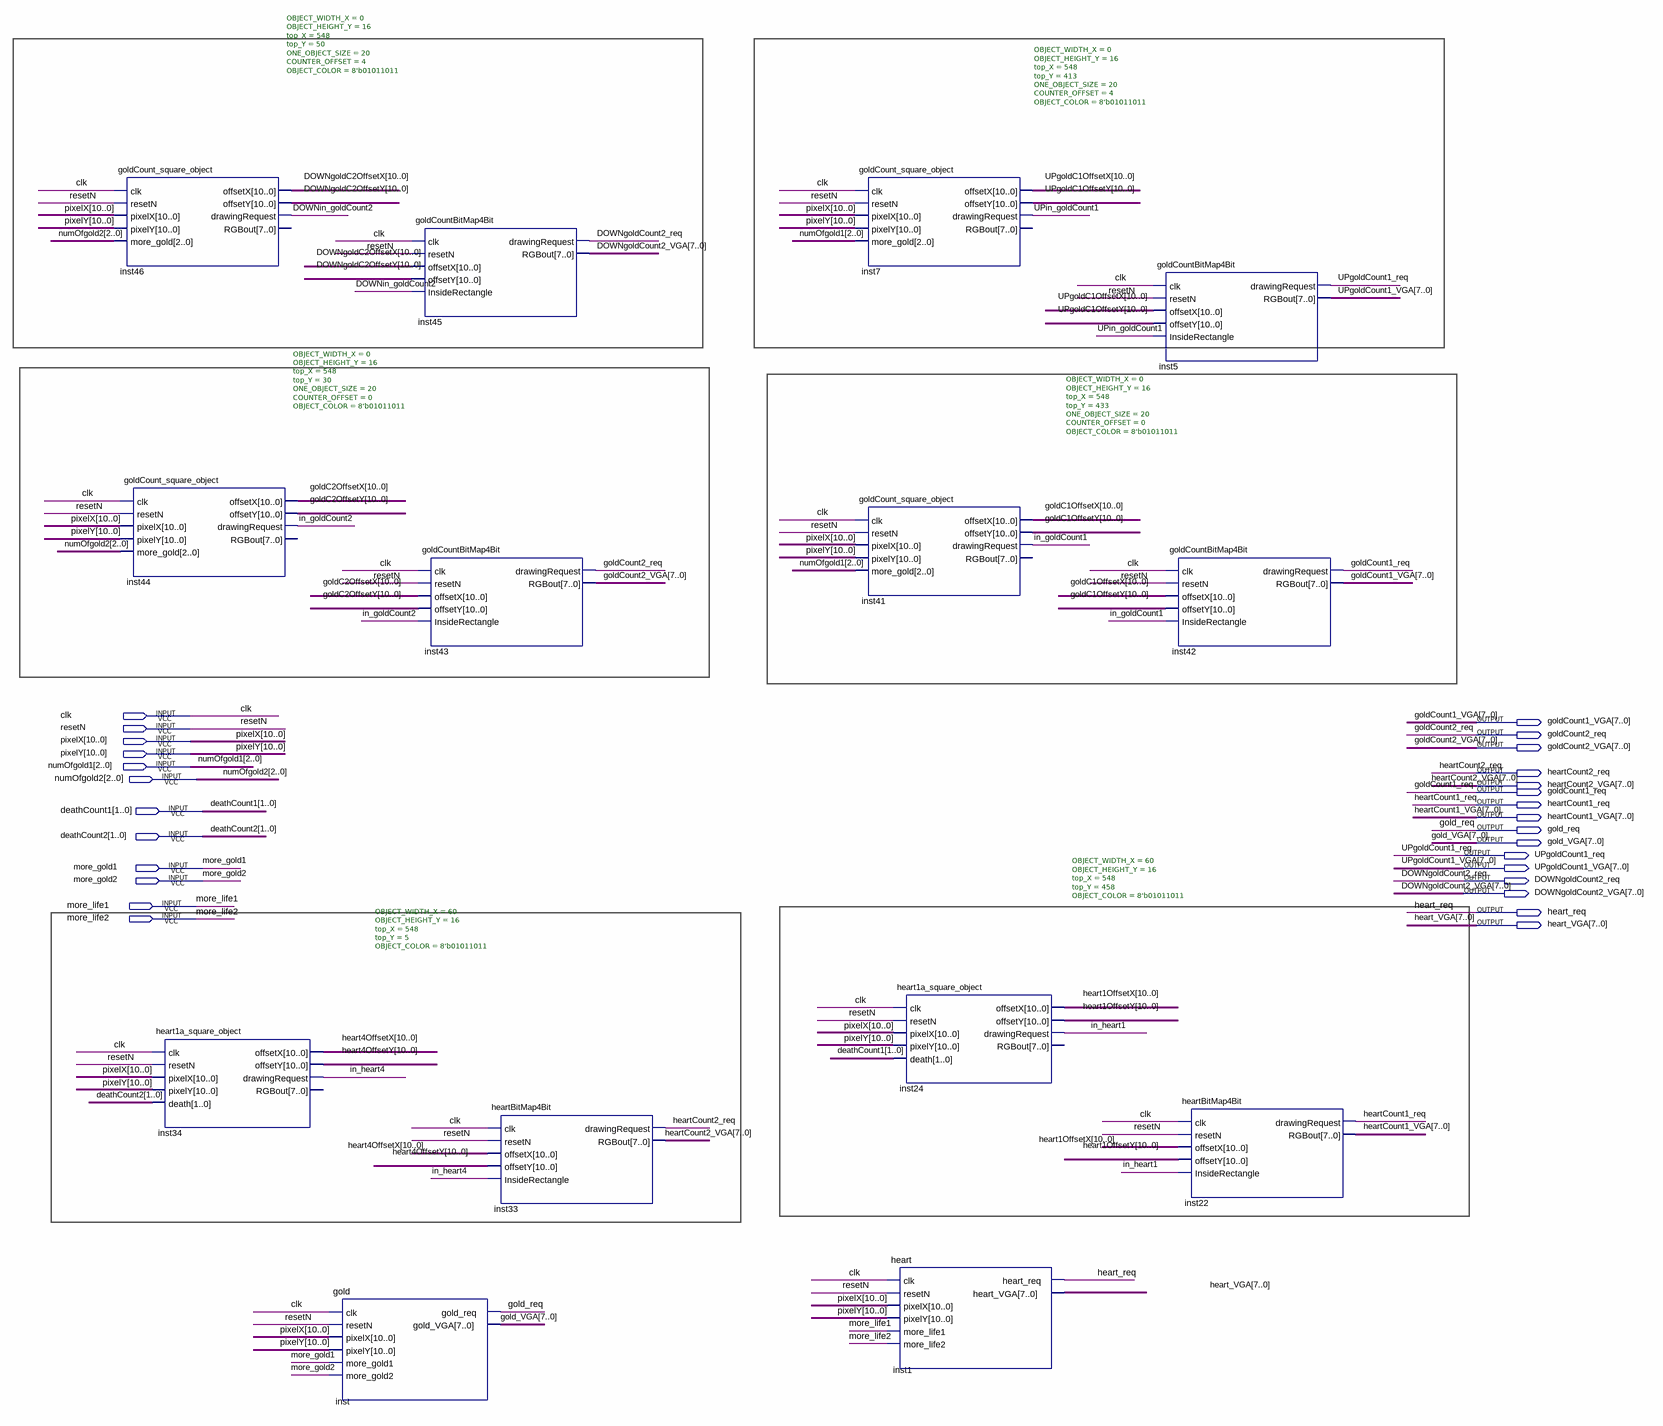
[diagram p0: schematic sheet]
// Quartus schematic counters.bdf as structural Verilog: 14 symbols, 28 pins
module counters (
  input  clk,
  input  resetN,
  input  [10:0] pixelX,
  input  [10:0] pixelY,
  input  [2:0] numOfgold1,
  input  [2:0] numOfgold2,
  input  [1:0] deathCount1,
  input  [1:0] deathCount2,
  input  more_gold1,
  input  more_gold2,
  input  more_life1,
  input  more_life2,
  output [7:0] goldCount1_VGA,
  output goldCount2_req,
  output [7:0] goldCount2_VGA,
  output heartCount2_req,
  output [7:0] heartCount2_VGA,
  output goldCount1_req,
  output heartCount1_req,
  output [7:0] heartCount1_VGA,
  output gold_req,
  output [7:0] gold_VGA,
  output UPgoldCount1_req,
  output [7:0] UPgoldCount1_VGA,
  output DOWNgoldCount2_req,
  output [7:0] DOWNgoldCount2_VGA,
  output heart_req,
  output [7:0] heart_VGA
);

  wire DOWNin_goldCount2, in_goldCount1, in_goldCount2, in_heart1, in_heart4, UPin_goldCount1;
  wire [10:0] DOWNgoldC2OffsetX, DOWNgoldC2OffsetY, goldC1OffsetX, goldC1OffsetY, goldC2OffsetX,
       goldC2OffsetY, heart1OffsetX, heart1OffsetY, heart4OffsetX, heart4OffsetY, UPgoldC1OffsetX,
       UPgoldC1OffsetY;

  goldCount_square_object #(.OBJECT_WIDTH_X(0), .OBJECT_HEIGHT_Y(16), .top_X(548), .top_Y(50), .ONE_OBJECT_SIZE(20), .COUNTER_OFFSET(4), .OBJECT_COLOR(8'b01011011)) inst46 (
    .clk(clk), .resetN(resetN), .pixelX(pixelX), .pixelY(pixelY), .more_gold(numOfgold2),
    .offsetX(DOWNgoldC2OffsetX), .offsetY(DOWNgoldC2OffsetY), .drawingRequest(DOWNin_goldCount2));  // open: RGBout
  goldCount_square_object #(.OBJECT_WIDTH_X(0), .OBJECT_HEIGHT_Y(16), .top_X(548), .top_Y(30), .ONE_OBJECT_SIZE(20), .COUNTER_OFFSET(0), .OBJECT_COLOR(8'b01011011)) inst44 (
    .clk(clk), .resetN(resetN), .pixelX(pixelX), .pixelY(pixelY), .more_gold(numOfgold2),
    .offsetX(goldC2OffsetX), .offsetY(goldC2OffsetY), .drawingRequest(in_goldCount2));  // open: RGBout
  heart1a_square_object #(.OBJECT_WIDTH_X(60), .OBJECT_HEIGHT_Y(16), .top_X(548), .top_Y(5), .OBJECT_COLOR(8'b01011011)) inst34 (
    .clk(clk), .resetN(resetN), .pixelX(pixelX), .pixelY(pixelY), .death(deathCount2),
    .offsetX(heart4OffsetX), .offsetY(heart4OffsetY), .drawingRequest(in_heart4));  // open: RGBout
  gold inst (
    .clk(clk), .resetN(resetN), .pixelX(pixelX), .pixelY(pixelY), .more_gold1(more_gold1),
    .more_gold2(more_gold2), .gold_req(gold_req), .gold_VGA(gold_VGA));
  goldCountBitMap4Bit inst45 (
    .clk(clk), .resetN(resetN), .offsetX(DOWNgoldC2OffsetX), .offsetY(DOWNgoldC2OffsetY),
    .InsideRectangle(DOWNin_goldCount2), .drawingRequest(DOWNgoldCount2_req), .RGBout(DOWNgoldCount2_VGA));
  goldCountBitMap4Bit inst43 (
    .clk(clk), .resetN(resetN), .offsetX(goldC2OffsetX), .offsetY(goldC2OffsetY),
    .InsideRectangle(in_goldCount2), .drawingRequest(goldCount2_req), .RGBout(goldCount2_VGA));
  heartBitMap4Bit inst33 (
    .clk(clk), .resetN(resetN), .offsetX(heart4OffsetX), .offsetY(heart4OffsetY),
    .InsideRectangle(in_heart4), .drawingRequest(heartCount2_req), .RGBout(heartCount2_VGA));
  goldCount_square_object #(.OBJECT_WIDTH_X(0), .OBJECT_HEIGHT_Y(16), .top_X(548), .top_Y(413), .ONE_OBJECT_SIZE(20), .COUNTER_OFFSET(4), .OBJECT_COLOR(8'b01011011)) inst7 (
    .clk(clk), .resetN(resetN), .pixelX(pixelX), .pixelY(pixelY), .more_gold(numOfgold1),
    .offsetX(UPgoldC1OffsetX), .offsetY(UPgoldC1OffsetY), .drawingRequest(UPin_goldCount1));  // open: RGBout
  goldCount_square_object #(.OBJECT_WIDTH_X(0), .OBJECT_HEIGHT_Y(16), .top_X(548), .top_Y(433), .ONE_OBJECT_SIZE(20), .COUNTER_OFFSET(0), .OBJECT_COLOR(8'b01011011)) inst41 (
    .clk(clk), .resetN(resetN), .pixelX(pixelX), .pixelY(pixelY), .more_gold(numOfgold1),
    .offsetX(goldC1OffsetX), .offsetY(goldC1OffsetY), .drawingRequest(in_goldCount1));  // open: RGBout
  heart1a_square_object #(.OBJECT_WIDTH_X(60), .OBJECT_HEIGHT_Y(16), .top_X(548), .top_Y(458), .OBJECT_COLOR(8'b01011011)) inst24 (
    .clk(clk), .resetN(resetN), .pixelX(pixelX), .pixelY(pixelY), .death(deathCount1),
    .offsetX(heart1OffsetX), .offsetY(heart1OffsetY), .drawingRequest(in_heart1));  // open: RGBout
  heart inst1 (
    .clk(clk), .resetN(resetN), .pixelX(pixelX), .pixelY(pixelY), .more_life1(more_life1),
    .more_life2(more_life2), .heart_req(heart_req), .heart_VGA(heart_VGA));
  goldCountBitMap4Bit inst5 (
    .clk(clk), .resetN(resetN), .offsetX(UPgoldC1OffsetX), .offsetY(UPgoldC1OffsetY),
    .InsideRectangle(UPin_goldCount1), .drawingRequest(UPgoldCount1_req), .RGBout(UPgoldCount1_VGA));
  goldCountBitMap4Bit inst42 (
    .clk(clk), .resetN(resetN), .offsetX(goldC1OffsetX), .offsetY(goldC1OffsetY),
    .InsideRectangle(in_goldCount1), .drawingRequest(goldCount1_req), .RGBout(goldCount1_VGA));
  heartBitMap4Bit inst22 (
    .clk(clk), .resetN(resetN), .offsetX(heart1OffsetX), .offsetY(heart1OffsetY),
    .InsideRectangle(in_heart1), .drawingRequest(heartCount1_req), .RGBout(heartCount1_VGA));
endmodule
